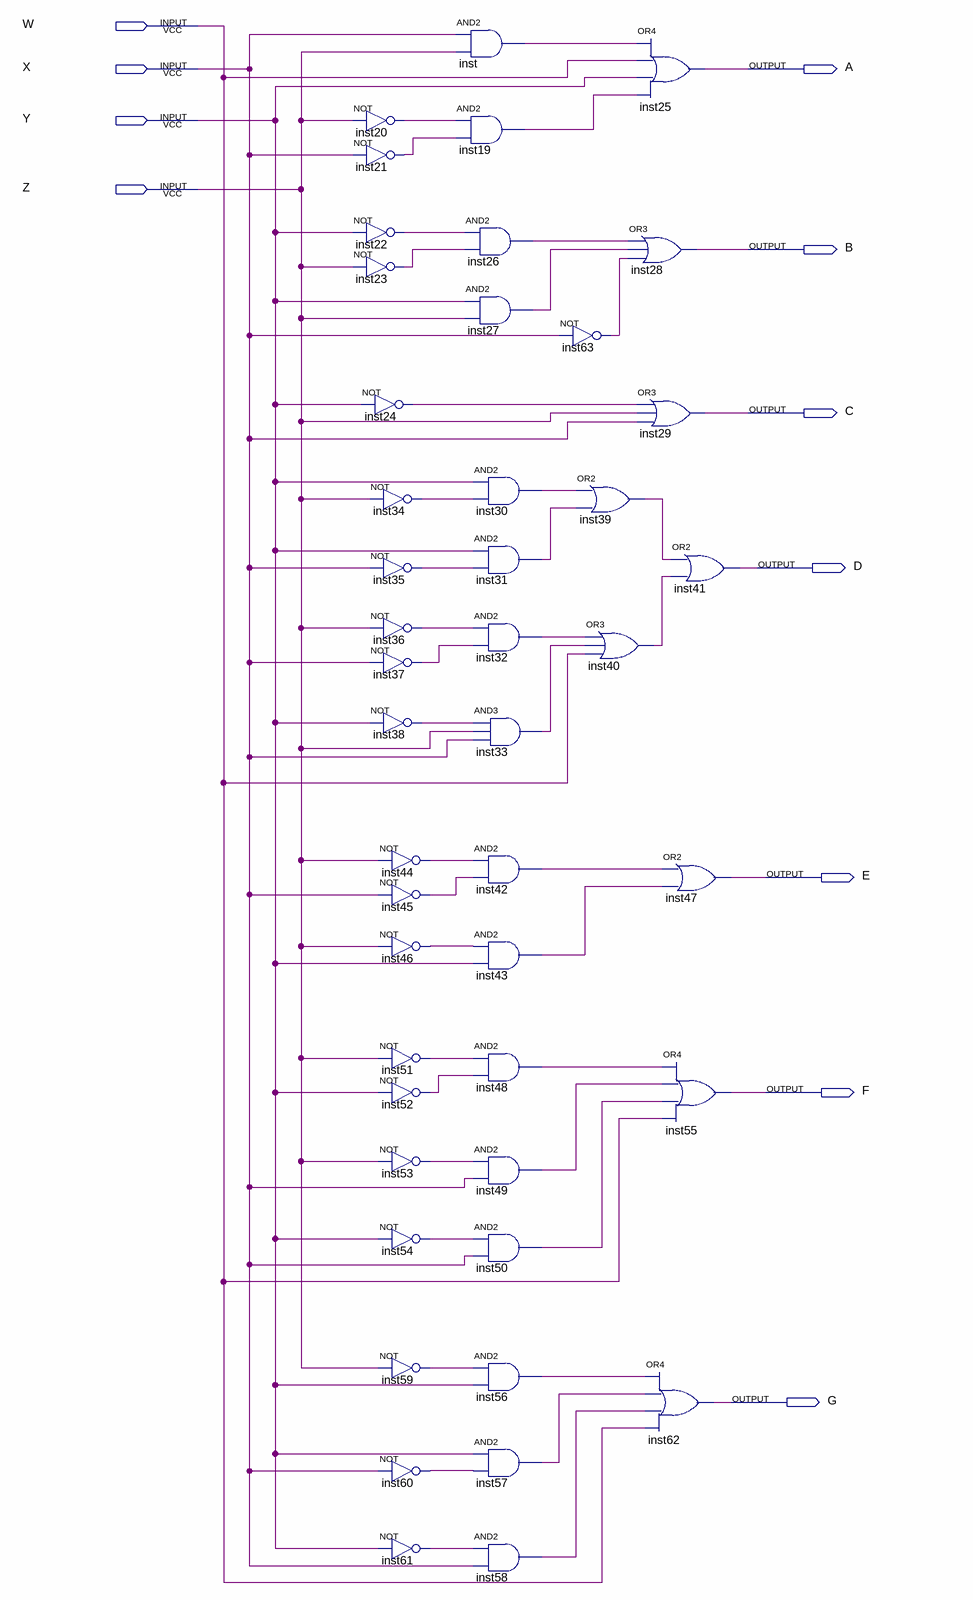
[diagram p0: schematic sheet]
// Quartus schematic Az1.bdf as structural Verilog: 46 symbols, 11 pins
module Az1 (
  input  W,
  input  X,
  input  Y,
  input  Z,
  output A,
  output B,
  output C,
  output D,
  output E,
  output F,
  output G
);

  wire inst19_out, inst20_out, inst21_out, inst22_out, inst23_out, inst24_out, inst26_out, inst27_out,
       inst30_out, inst31_out, inst32_out, inst33_out, inst34_out, inst35_out, inst36_out, inst37_out,
       inst38_out, inst39_out, inst40_out, inst42_out, inst43_out, inst44_out, inst45_out, inst46_out,
       inst48_out, inst49_out, inst50_out, inst51_out, inst52_out, inst53_out, inst54_out, inst56_out,
       inst57_out, inst58_out, inst59_out, inst60_out, inst61_out, inst63_out, inst_out;

  not inst20 (inst20_out, Z);
  not inst21 (inst21_out, X);
  not inst22 (inst22_out, Y);
  not inst23 (inst23_out, Z);
  not inst24 (inst24_out, Y);
  not inst34 (inst34_out, Z);
  not inst35 (inst35_out, X);
  not inst36 (inst36_out, Z);
  not inst37 (inst37_out, X);
  not inst38 (inst38_out, Y);
  not inst44 (inst44_out, Z);
  not inst45 (inst45_out, X);
  not inst46 (inst46_out, Z);
  not inst51 (inst51_out, Z);
  not inst52 (inst52_out, Y);
  not inst53 (inst53_out, Z);
  not inst54 (inst54_out, Y);
  not inst59 (inst59_out, Z);
  not inst60 (inst60_out, X);
  not inst61 (inst61_out, Y);
  and inst (inst_out, X, Z);
  and inst19 (inst19_out, inst20_out, inst21_out);
  and inst26 (inst26_out, inst22_out, inst23_out);
  and inst27 (inst27_out, Y, Z);
  and inst30 (inst30_out, Y, inst34_out);
  and inst31 (inst31_out, Y, inst35_out);
  and inst32 (inst32_out, inst36_out, inst37_out);
  and inst33 (inst33_out, inst38_out, Z, X);
  and inst42 (inst42_out, inst44_out, inst45_out);
  and inst43 (inst43_out, inst46_out, Y);
  and inst48 (inst48_out, inst51_out, inst52_out);
  and inst49 (inst49_out, inst53_out, X);
  and inst50 (inst50_out, inst54_out, X);
  and inst56 (inst56_out, inst59_out, Y);
  and inst57 (inst57_out, Y, inst60_out);
  and inst58 (inst58_out, inst61_out, X);
  not inst63 (inst63_out, X);
  or inst39 (inst39_out, inst30_out, inst31_out);
  or inst40 (inst40_out, inst32_out, inst33_out, W);
  or inst25 (A, inst_out, W, Y, inst19_out);
  or inst28 (B, inst26_out, inst27_out, inst63_out);
  or inst29 (C, inst24_out, Z, X);
  or inst41 (D, inst39_out, inst40_out);
  or inst47 (E, inst42_out, inst43_out);
  or inst55 (F, inst48_out, inst49_out, inst50_out, W);
  or inst62 (G, inst56_out, inst57_out, inst58_out, W);
endmodule
